# EAGLE design modulator_r1 (EAGLE 6.5.0)
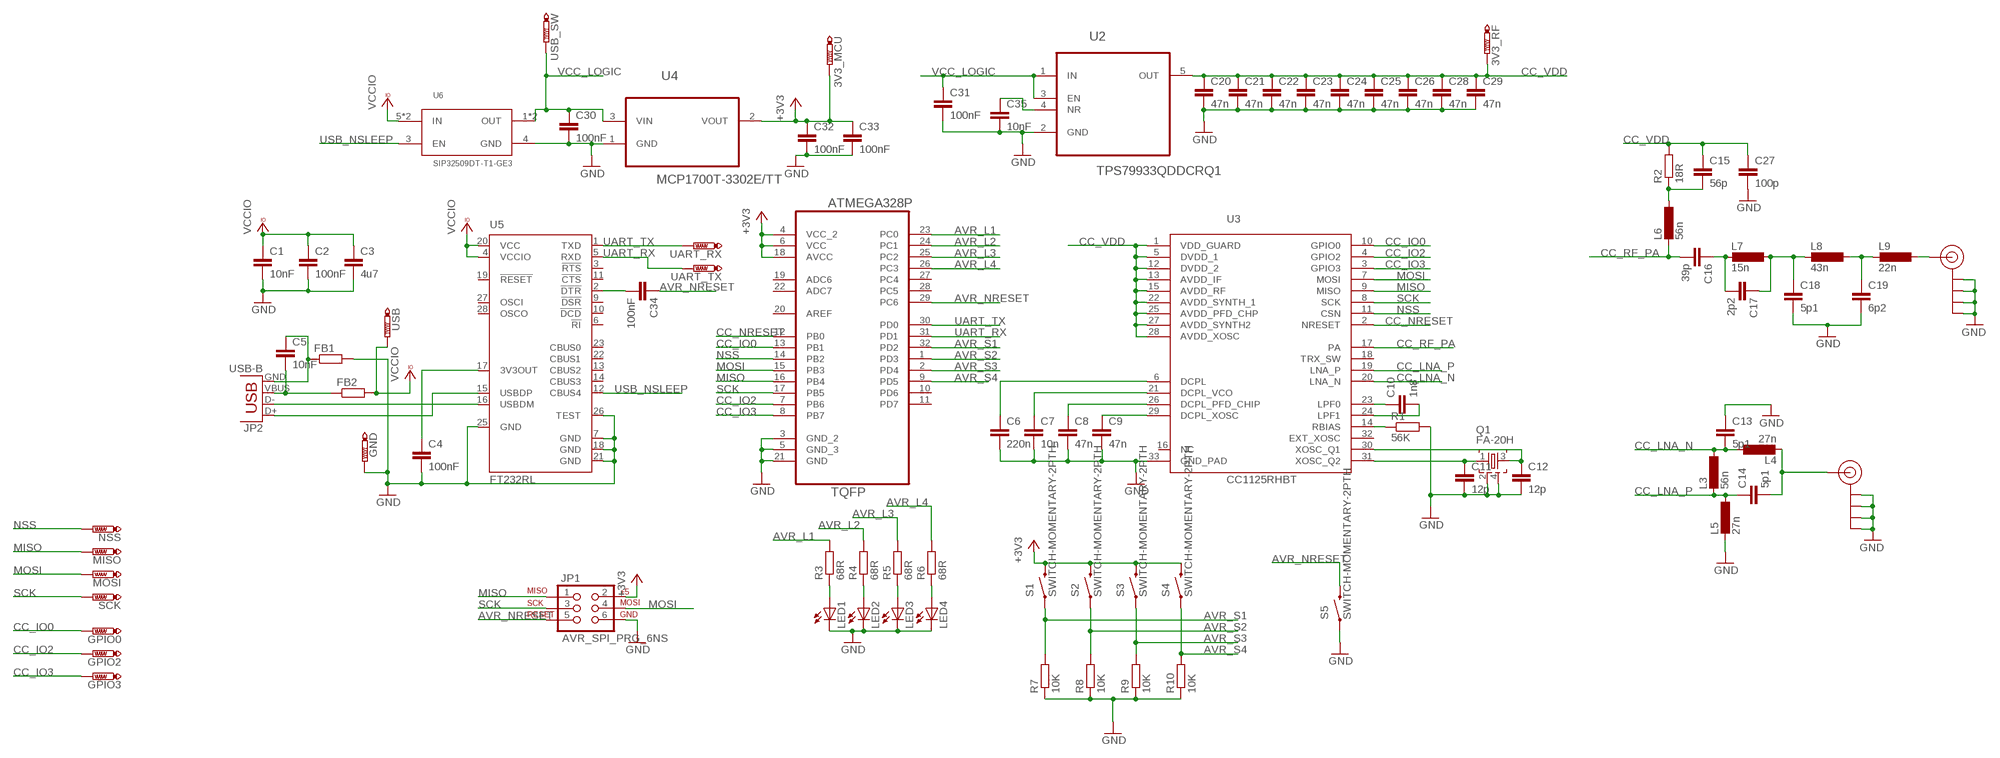
[diagram p0: schematic, sheet 1]

## Parts
3V3_MCU  PTR1B2,54  [B2,54]
3V3_RF  PTR1B2,54  [B2,54]
C1  10nF  C-EUC0603  [C0603]
C2  100nF  C-EUC0603  [C0603]
C3  4u7  C-EUC0603  [C0603]
C4  100nF  C-EUC0603  [C0603]
C5  10nF  C-EUC0603  [C0603]
C6  220n  C-EUC0402  [C0402]
C7  10n  C-EUC0402  [C0402]
C8  47n  C-EUC0402  [C0402]
C9  47n  C-EUC0402  [C0402]
C10  1n8  C-EUC0402  [C0402]
C11  12p  C-EUC0402  [C0402]
C12  12p  C-EUC0402  [C0402]
C13  5p1  C-EUC0402  [C0402]
C14  5p1  C-EUC0402  [C0402]
C15  56p  C-EUC0402  [C0402]
C16  39p  C-EUC0402  [C0402]
C17  2p2  C-EUC0402  [C0402]
C18  5p1  C-EUC0402  [C0402]
C19  6p2  C-EUC0402  [C0402]
C20  47n  C-EUC0402  [C0402]
C21  47n  C-EUC0402  [C0402]
C22  47n  C-EUC0402  [C0402]
C23  47n  C-EUC0402  [C0402]
C24  47n  C-EUC0402  [C0402]
C25  47n  C-EUC0402  [C0402]
C26  47n  C-EUC0402  [C0402]
C27  100p  C-EUC0402  [C0402]
C28  47n  C-EUC0402  [C0402]
C29  47n  C-EUC0402  [C0402]
C30  100nF  C-EUC0603  [C0603]
C31  100nF  C-EUC0603  [C0603]
C32  100nF  C-EUC0603  [C0603]
C33  100nF  C-EUC0603  [C0603]
C34  100nF  C-EUC0603  [C0603]
C35  10nF  C-EUC0603  [C0603]
FB1  R-EU_R0603  [R0603]
FB2  R-EU_R0603  [R0603]
GND  PTR1B2,54  [B2,54]
GPIO0  PTR1B1,27  [B1,27]
GPIO2  PTR1B1,27  [B1,27]
GPIO3  PTR1B1,27  [B1,27]
J$1  SMA_EDGE  [SMA-EDGE]
J$2  SMA_EDGE  [SMA-EDGE]
JP1  AVR_SPI_PRG_6NS  [2X3-NS]
JP2  USB-B  USBPTH  [USB-B-PTH]
L3  56n  L-EUL0402  [R0402]
L4  27n  L-EUL0402  [R0402]
L5  27n  L-EUL0402  [R0402]
L6  56n  L-EUL0402  [R0402]
L7  15n  L-EUL0402  [R0402]
L8  43n  L-EUL0402  [R0402]
L9  22n  L-EUL0402  [R0402]
LED1  LEDCHIPLED_1206  [CHIPLED_1206]
LED2  LEDCHIPLED_1206  [CHIPLED_1206]
LED3  LEDCHIPLED_1206  [CHIPLED_1206]
LED4  LEDCHIPLED_1206  [CHIPLED_1206]
MISO  PTR1B1,27  [B1,27]
MOSI  PTR1B1,27  [B1,27]
NSS  PTR1B1,27  [B1,27]
Q1  FA-20H  [FA-20H]
R1  56K  R-EU_R0402  [R0402]
R2  18R  R-EU_R0402  [R0402]
R3  68R  R-EU_R0603  [R0603]
R4  68R  R-EU_R0603  [R0603]
R5  68R  R-EU_R0603  [R0603]
R6  68R  R-EU_R0603  [R0603]
R7  10K  R-EU_R0603  [R0603]
R8  10K  R-EU_R0603  [R0603]
R9  10K  R-EU_R0603  [R0603]
R10  10K  R-EU_R0603  [R0603]
S1  SWITCH-MOMENTARY-2PTH  [TACTILE-PTH]
S2  SWITCH-MOMENTARY-2PTH  [TACTILE-PTH]
S3  SWITCH-MOMENTARY-2PTH  [TACTILE-PTH]
S4  SWITCH-MOMENTARY-2PTH  [TACTILE-PTH]
S5  SWITCH-MOMENTARY-2PTH  [TACTILE-PTH]
SCK  PTR1B1,27  [B1,27]
U1  ATMEGA328P-AU  [QFP80P900X900X120-32N]
U2  TPS79933QDDCRQ1  [SOT95P280X110-5N]
U3  CC1125RHBT  [QFN50P500X500X100-32N]
U4  MCP1700T-3302E/TT  [SOT95P237X112-3N]
U5  FT232RL  [SSOP28]
U6  SIP32509DT-T1-GE3  [SOT23-6]
UART_RX  PTR1B1,27  [B1,27]
UART_TX  PTR1B1,27  [B1,27]
USB  PTR1B2,54  [B2,54]
USB_SW  PTR1B2,54  [B2,54]

## Nets
+3V3: 3V3_MCU.TP C32.1 C33.1 JP1.2 S1.3 S2.3 S3.3 S4.3 U1.4(VCC_2) U1.6(VCC) U1.18(AVCC) U4.2(VOUT)
AVR_L1: R3.2 U1.23(PC0)
AVR_L2: R4.2 U1.24(PC1)
AVR_L3: R5.2 U1.25(PC2)
AVR_L4: R6.2 U1.26(PC3)
AVR_NRESET: C34.1 JP1.5 S5.3 U1.29(PC6)
AVR_S1: R7.2 S1.1 U1.32(PD2)
AVR_S2: R8.2 S2.1 U1.1(PD3)
AVR_S3: R9.2 S3.1 U1.2(PD4)
AVR_S4: R10.2 S4.1 U1.9(PD5)
CC_IO0: GPIO0.TP U1.13(PB1) U3.10(GPIO0)
CC_IO2: GPIO2.TP U1.7(PB6) U3.4(GPIO2)
CC_IO3: GPIO3.TP U1.8(PB7) U3.3(GPIO3)
CC_LNA_N [RF]: C13.2 L3.1 L4.1 U3.20(LNA_N)
CC_LNA_P [RF]: C14.1 L3.2 L5.1 U3.19(LNA_P)
CC_NRESET: U1.12(PB0) U3.2(NRESET)
CC_RF_PA [RF]: C16.2 L6.2 U3.17(PA)
CC_VDD: 3V3_RF.TP C15.1 C20.1 C21.1 C22.1 C23.1 C24.1 C25.1 C26.1 C27.1 C28.1 C29.1 R2.2 U2.5(OUT) U3.1(VDD_GUARD) U3.5(DVDD_1) U3.12(DVDD_2) U3.13(AVDD_IF) U3.15(AVDD_RF) U3.22(AVDD_SYNTH_1) U3.25(AVDD_PFD_CHP) U3.27(AVDD_SYNTH2) U3.28(AVDD_XOSC)
GND: C1.2 C2.2 C3.2 C4.2 C6.2 C7.2 C8.2 C9.2 C11.2 C12.2 C13.1 C18.2 C19.2 C20.2 C21.2 C22.2 C23.2 C24.2 C25.2 C26.2 C27.2 C28.2 C29.2 C30.2 C31.2 C32.2 C33.2 C35.2 FB1.2 GND.TP J$1.GND@0(GND) J$1.GND@1(GND) J$1.GND@2(GND) J$1.GND@3(GND) J$2.GND@0(GND) J$2.GND@1(GND) J$2.GND@2(GND) J$2.GND@3(GND) JP1.6 L5.2 LED1.C LED2.C LED3.C LED4.C Q1.2 Q1.4 R1.2 R7.1 R8.1 R9.1 R10.1 S5.1 U1.3(GND_2) U1.5(GND_3) U1.21(GND) U2.2(GND) U3.33(GND_PAD) U4.1(GND) U5.7(GND) U5.18(GND) U5.21(GND) U5.25(GND) U5.26(TEST) U6.4(GND)
MISO: JP1.1 MISO.TP U1.16(PB4) U3.9(MISO)
MOSI: JP1.4 MOSI.TP U1.15(PB3) U3.7(MOSI)
N$1: JP2.D- U5.16(USBDM)
N$2: JP2.D+ U5.15(USBDP)
N$3: C5.1 FB1.1 JP2.GND
N$4: C5.2 FB2.1 JP2.VBUS
N$5: C4.1 U5.17(3V3OUT)
N$6 [RF]: J$2.SIG(SIGNAL) L9.1
N$7: R1.1 U3.14(RBIAS)
N$8: C9.1 U3.29(DCPL_XOSC)
N$9: C8.1 U3.26(DCPL_PFD_CHIP)
N$10: C7.1 U3.21(DCPL_VCO)
N$11: C6.1 U3.6(DCPL)
N$12: C10.2 U3.24(LPF1)
N$13: C10.1 U3.23(LPF0)
N$14: C11.1 Q1.1 U3.31(XOSC_Q2)
N$15: C19.1 L8.1 L9.2
N$16: C12.1 Q1.3 U3.30(XOSC_Q1)
N$17 [RF]: C14.2 J$1.SIG(SIGNAL) L4.2
N$18 [RF]: C17.1 C18.1 L7.1 L8.2
N$19 [RF]: C16.1 C17.2 L7.2
N$20: C34.2 U5.2(!DTR)
N$21: C15.2 L6.1 R2.1
N$22: LED1.A R3.1
N$23: LED2.A R4.1
N$24: LED3.A R5.1
N$25: LED4.A R6.1
N$30: C35.1 U2.4(NR)
NSS: NSS.TP U1.14(PB2) U3.11(CSN)
SCK: JP1.3 SCK.TP U1.17(PB5) U3.8(SCK)
UART_RX: U1.31(PD1) U5.5(RXD) UART_TX.TP
UART_TX: U1.30(PD0) U5.1(TXD) UART_RX.TP
USB_NSLEEP: U5.12(CBUS4) U6.3(EN)
VCC_LOGIC: C30.1 C31.1 U2.1(IN) U2.3(EN) U4.3(VIN) U6.1(OUT) U6.2(OUT) USB_SW.TP
VCCIO: C1.1 C2.1 C3.1 FB2.2 U5.4(VCCIO) U5.20(VCC) U6.5(IN) U6.6(IN) USB.TP
Unconnected: U1.10(PD6) U1.11(PD7) U1.19(ADC6) U1.20(AREF) U1.22(ADC7) U1.27(PC4) U1.28(PC5) U3.16(NC) U3.18(TRX_SW) U3.32(EXT_XOSC) U5.3(!RTS) U5.6(!RI) U5.9(!DSR) U5.10(!DCD) U5.11(!CTS) U5.13(CBUS2) U5.14(CBUS3) U5.19(!RESET) U5.22(CBUS1) U5.23(CBUS0) U5.27(OSCI) U5.28(OSCO)

## Library data of the parts
3V3_MCU 3V3_RF GND GPIO0 GPIO2 GPIO3 MISO MOSI NSS SCK UART_RX UART_TX USB USB_SW = testpad:PTR1: TEST PIN
C1-C35 = resistor:C-EU: CAPACITOR, European symbol
FB1 FB2 R1-R10 = resistor:R-EU_: RESISTOR, European symbol
J$1 J$2 = SparkFun-Connectors:SMA_EDGE: SMA Antenna Connector End launch SMA connector. The paste layer has been removed so that the connector can be hand soldered onto the board after reflow.
JP1 = SparkFun-Connectors:AVR_SPI_PRG_6: AVR ISP 6 Pin This is the reduced ISP connector for AVR programming. Common on Arduino. This footprint will take up less PCB space and can be used with a 10-pin to 6-pin adapter such as SKU: BOB-08508 **Special note about "TEST_POINT" package. The stop mask is on the top side, so if you want your programming test points to be on the bottom of your board, make sure to place this package on the bottom side of the board. This also ensure that the orientation to program from the bottom side will be correct.
JP2 = SparkFun-Connectors:USB: USB Connectors USB-B-PTH is fully proven SKU : PRT-00139/CONN-08278 USB-miniB is fully proven SKU : PRT-00587 USB-A-PCB is untested. USB-A-H is throughly reviewed, but untested. Spark Fun Electronics SKU : PRT-00437 USB-B-SMT is throughly reviewed, but untested. Needs silkscreen touching up. USB-A-S has not been used/tested USB-MB-H has not been used/tested USB-MICROB has been used. CONN-09505; PROD_ID: CONN-08278
L3-L9 = resistor:L-EU: INDUCTOR, European symbol
LED1-LED4 = led:LED: LED OSRAM: - CHIPLED LG R971, LG N971, LY N971, LG Q971, LY Q971, LO R971, LY R971 LH N974, LH R974 LS Q976, LO Q976, LY Q976 LO Q996 - Hyper CHIPLED LW Q18S LB Q993, LB Q99A, LB R99A - SideLED LS A670, LO A670, LY A670, LG A670, LP A670 LB A673, LV A673, LT A673, LW A673 LH A674 LY A675 LS A676, LA A676, LO A676, LY A676, LW A676 LS A679, LY A679, LG A679 - Hyper Micro SIDELED® LS Y876, LA Y876, LO Y876, LY Y876 LT Y87S - SmartLED LW L88C, LW L88S LB L89C, LB L89S, LG L890 LS L89K, LO L89K, LY L89K LS L896, LA L896, LO L896, LY L896 - TOPLED LS T670, LO T670, LY T670, LG T670, LP T670 LSG T670, LSP T670, LSY T670, LOP T670, LYG T670 LG T671, LOG T671, LSG T671 LB T673, LV T673, LT T673, LW T673 LH T674 LS T676, LA T676, LO T676, LY T676, LB T676, LH T676, LSB T676, LW T676 LB T67C, LV T67C, LT T67C, LS T67K, LO T67K, LY T67K, LW E67C LS E67B, LA E67B, LO E67B, LY E67B, LB E67C, LV E67C, LT E67C LW T67C LS T679, LY T679, LG T679 LS T770, LO T770, LY T770, LG T770, LP T770 LB T773, LV T773, LT T773, LW T773 LH T774 LS E675, LA E675, LY E675, LS T675 LS T776, LA T776, LO T776, LY T776, LB T776 LHGB T686 LT T68C, LB T68C - Hyper Mini TOPLED® LB M676 - Mini TOPLED Santana® LG M470 LS M47K, LO M47K, LY M47K Source: http://www.osram.convergy.de LUXEON: - LUMILED® LXK2-PW12-R00, LXK2-PW12-S00, LXK2-PW14-U00, LXK2-PW14-V00 LXK2-PM12-R00, LXK2-PM12-S00, LXK2-PM14-U00 LXK2-PE12-Q00, LXK2-PE12-R00, LXK2-PE12-S00, LXK2-PE14-T00, LXK2-PE14-U00 LXK2-PB12-K00, LXK2-PB12-L00, LXK2-PB12-M00, LXK2-PB14-N00, LXK2-PB14-P00, LXK2-PB14-Q00 LXK2-PR12-L00, LXK2-PR12-M00, LXK2-PR14-Q00, LXK2-PR14-R00 LXK2-PD12-Q00, LXK2-PD12-R00, LXK2-PD12-S00 LXK2-PH12-R00, LXK2-PH12-S00 LXK2-PL12-P00, LXK2-PL12-Q00, LXK2-PL12-R00 Source: www.luxeon.com KINGBRIGHT: KA-3528ASYC Source: www.kingbright.com
Q1 = crystal:FA-: MHz RANGE CRYSTAL UNIT Source: Epson Toyocom
S1-S5 = SparkFun-Electromechanical:SWITCH-MOMENTARY-2: Various NO switches- pushbuttons, reed, etc; PROD_ID: SWCH-08441
U1 = Ava:ATMEGA328P-AU; DESCRIPTION: 8-bit Microcontroller with In-System Programmable Flash; MPN: ATMEGA328P-AU; OC_FARNELL: 1715486; OC_NEWARK: 14R4631; PACKAGE: TQFP-32; SUPPLIER: Atmel
U2 = Texas Instruments_By_element14_Batch_1:TPS79933QDDCRQ1: LINEAR REGULATOR; MPN: TPS79933QDDCRQ1; OC_FARNELL: -; OC_NEWARK: 25R0151; PACKAGE: SOT-5; SUPPLIER: Texas Instruments
U3 = Texas Instruments_By_element14_Batch_1:CC1125RHBT; FARNELL_OC: 2422924
U4 = Ava:MCP1700T-3302E/TT: Low Quiescent Current LDO; MPN: MCP1700T-3302E/TT; OC_FARNELL: 1296592; OC_NEWARK: 88H9817; PACKAGE: SOT23-3; SUPPLIER: Microchip
U5 = ftdichip:FT232R: Source: http://www.ftdichip.com/Documents/DataSheets/DS_FT232R_v104.pdf; MPN: FT232RL; OC_FARNELL: 1146032; OC_NEWARK: 91K9918
U6 = phil-ic:SIP32509DT-T1-GE3: 1.1 V to 5.5 V, Slew Rate Controlled Load Switch; OC_FARNELL: 2361513

## Net classes
1 RF: clearance 0.254 mm

## Board
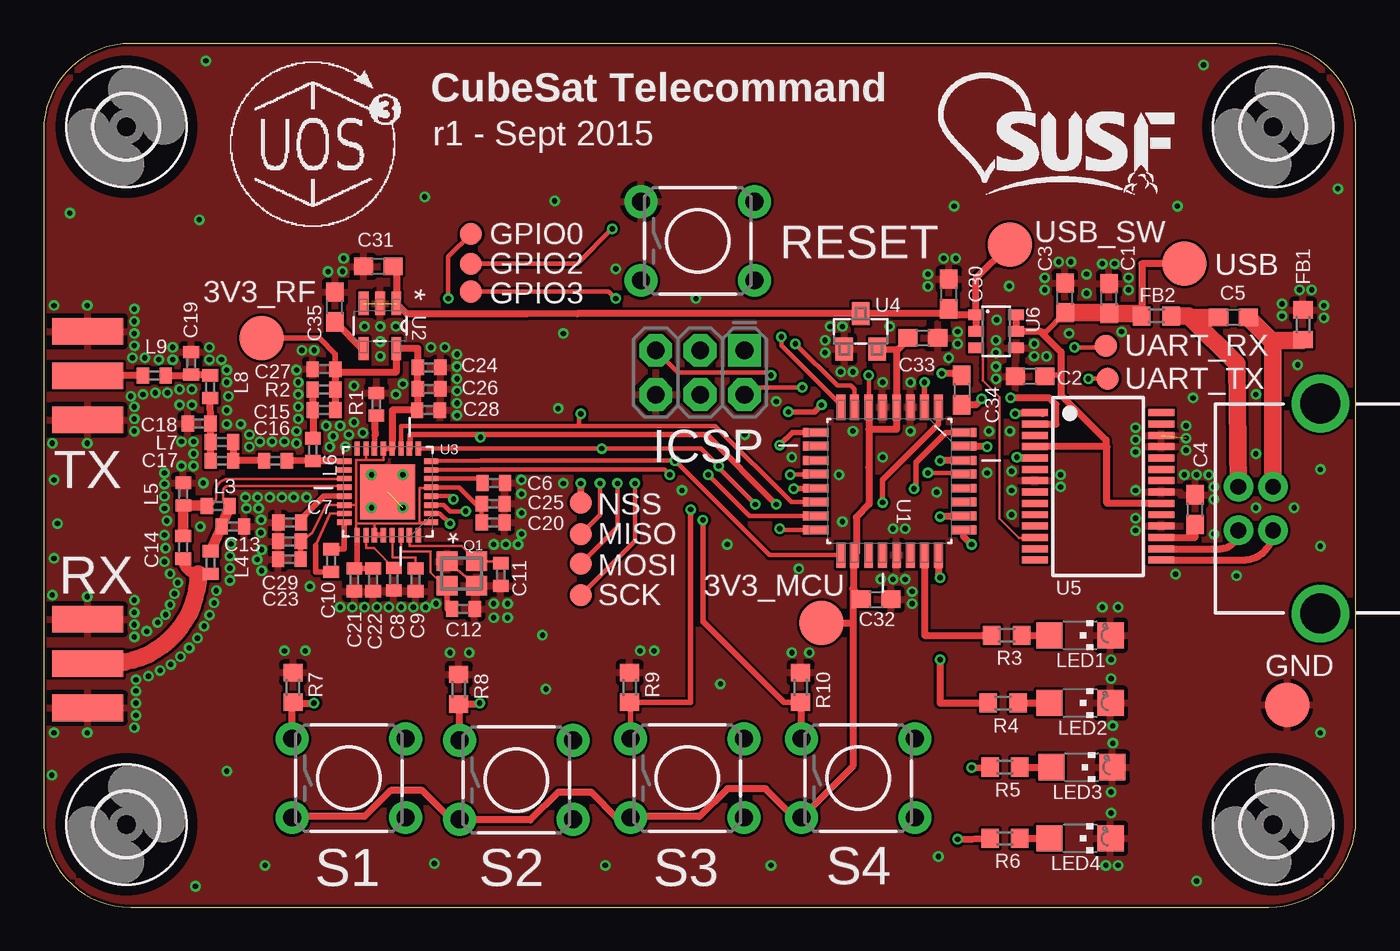
[diagram p1: board, top side]
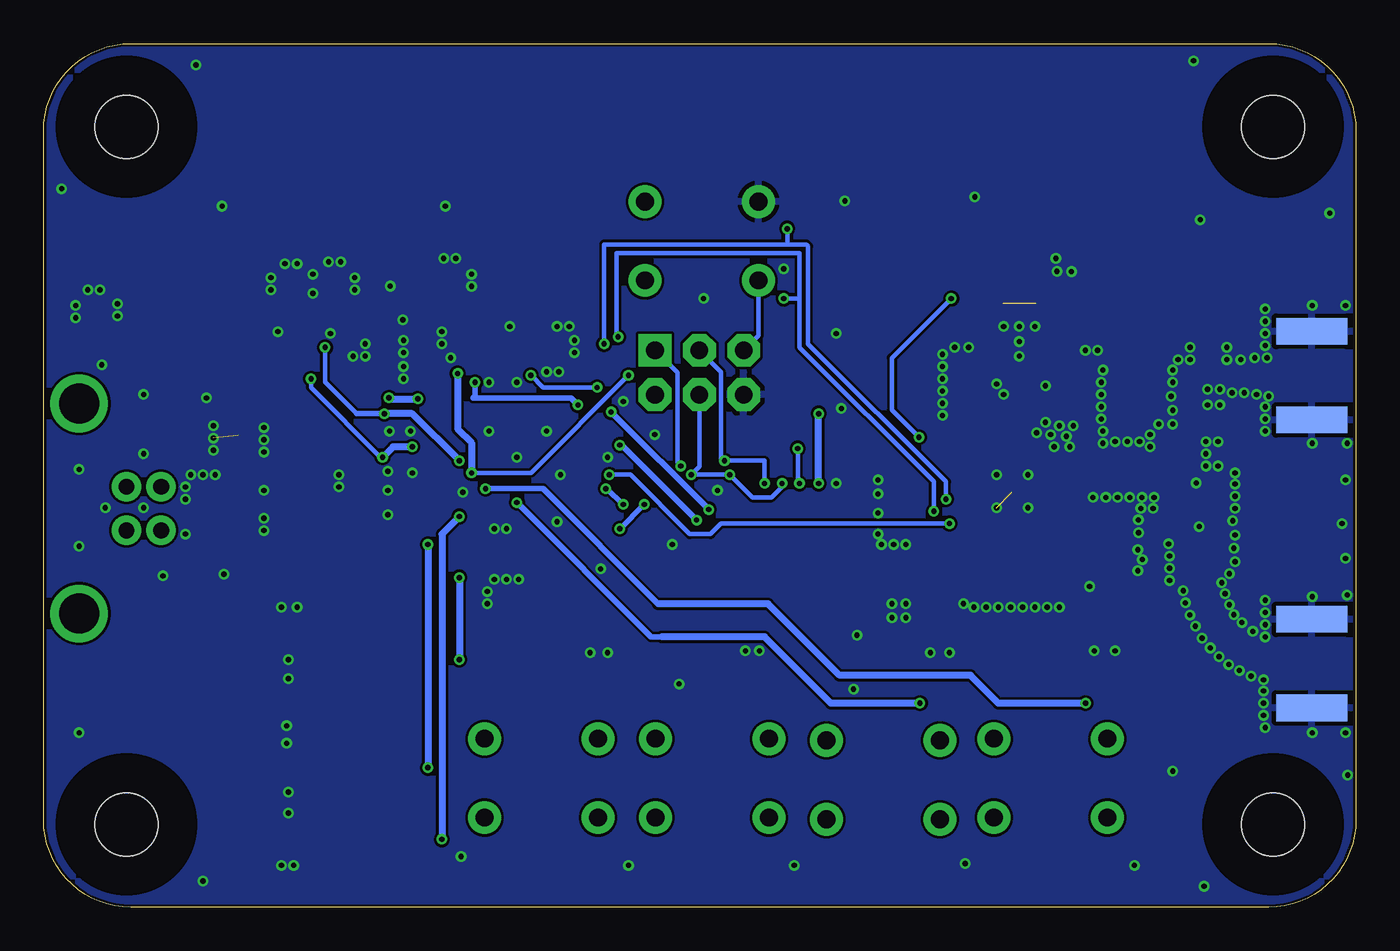
[diagram p2: board, bottom side, seen from below]

Size 75.23 x 49.52 mm. Coordinates in mm from the lower left corner, seen from the top.
Outline: 5,0 70.23,0 arc90 75.23,5 75.23,44.52 arc90 70.23,49.52 5,49.52 arc90 0,44.52 0,5 arc90 5,0
Copper layers (1*16): Top 0.035mm / dielectric 1.5mm / Bottom 0.035mm
Design rules "Hackvana": minimum track width 6mil, minimum drill 0.3mm, track to track 6mil, track to pad 6mil, pad to pad 6mil, via to via 6mil, smd to smd 0mil, copper to edge 6mil, drill to drill 6mil, minimum pad ring 10mil, minimum via ring 6mil, stop-mask expansion 2mil, vias tented up to drill 100mil, thermal gap 10mil

### Footprints (pad centres in the part's own frame; a part is rotated, then mirrored left to right if it is on the bottom)
B2,54 = smd 2.54 x 2.54: TP 0,0
C0603 = smd 1.1 x 1: 1 -0.85,0; 2 0.85,0
C0402 = smd 0.7 x 0.9: 1 -0.65,0; 2 0.65,0
R0603 = smd 1 x 1.1: 1 -0.85,0; 2 0.85,0
B1,27 = smd 1.27 x 1.27: TP 0,0
SMA-EDGE = smd 1.524 x 4.064: GND@0 0,0; GND@1 5.08,0; SIG 2.54,0 | smd 1.524 x 4.064 bottom: GND@2 0,0; GND@3 5.08,0
2X3-NS = drill 1.016 pad 1.88 square: 1 -2.54,-1.27 | drill 1.016 pad 1.88 octagon: 2 -2.54,1.27; 3 0,-1.27; 4 0,1.27; 5 2.54,-1.27; 6 2.54,1.27
USB-B-PTH = drill 0.914 pad 1.676: D+ 0,1.25; D- 1.981,1.25; GND 0,-1.25; VBUS 1.981,-1.25 | drill 2.286: S1 -2.718,-6.02; S2 -2.718,6.02
R0402 = smd 0.7 x 0.9: 1 -0.65,0; 2 0.65,0
CHIPLED_1206 = smd 1.5 x 1.5: A 0,-1.75; C 0,1.75
FA-20H = smd 1.2 x 1.1: 1 -0.85,-0.7; 2 0.85,-0.7; 3 0.85,0.7; 4 -0.85,0.7
TACTILE-PTH = drill 1.016 pad 1.88: 1 -3.251,2.261; 2 3.251,2.261; 3 -3.251,-2.261; 4 3.251,-2.261
QFP80P900X900X120-32N = smd 1.473 x 0.508: 1 -4.242,2.794; 2 -4.242,2.007; 3 -4.242,1.194; 4 -4.242,0.406; 5 -4.242,-0.406; 6 -4.242,-1.194; 7 -4.242,-2.007; 8 -4.242,-2.794; 17 4.242,-2.794; 18 4.242,-2.007; 19 4.242,-1.194; 20 4.242,-0.406; 21 4.242,0.406; 22 4.242,1.194; 23 4.242,2.007; 24 4.242,2.794 | smd 0.508 x 1.473: 9 -2.794,-4.242; 10 -2.007,-4.242; 11 -1.194,-4.242; 12 -0.406,-4.242; 13 0.406,-4.242; 14 1.194,-4.242; 15 2.007,-4.242; 16 2.794,-4.242; 25 2.794,4.242; 26 2.007,4.242; 27 1.194,4.242; 28 0.406,4.242; 29 -0.406,4.242; 30 -1.194,4.242; 31 -2.007,4.242; 32 -2.794,4.242
SOT95P280X110-5N = smd 1.321 x 0.559: 1 -1.295,0.94; 2 -1.295,0; 3 -1.295,-0.94; 4 1.295,-0.94; 5 1.295,0.94
QFN50P500X500X100-32N = smd 0.813 x 0.305: 1 -2.489,1.753; 2 -2.489,1.245; 3 -2.489,0.762; 4 -2.489,0.254; 5 -2.489,-0.254; 6 -2.489,-0.762; 7 -2.489,-1.245; 8 -2.489,-1.753; 17 2.489,-1.753; 18 2.489,-1.245; 19 2.489,-0.762; 20 2.489,-0.254; 21 2.489,0.254; 22 2.489,0.762; 23 2.489,1.245; 24 2.489,1.753 | smd 0.305 x 0.813: 9 -1.753,-2.489; 10 -1.245,-2.489; 11 -0.762,-2.489; 12 -0.254,-2.489; 13 0.254,-2.489; 14 0.762,-2.489; 15 1.245,-2.489; 16 1.753,-2.489; 25 1.753,2.489; 26 1.245,2.489; 27 0.762,2.489; 28 0.254,2.489; 29 -0.254,2.489; 30 -0.762,2.489; 31 -1.245,2.489; 32 -1.753,2.489 | smd 3.15 x 3.15: 33 0,0
SOT95P237X112-3N = smd 0.991 x 1.321: 1 -0.94,-1.016; 2 0.94,-1.016; 3 0,1.016
SSOP28 = smd 0.4 x 1.5: 1 -4.225,-3.625; 2 -3.575,-3.625; 3 -2.925,-3.625; 4 -2.275,-3.625; 5 -1.625,-3.625; 6 -0.975,-3.625; 7 -0.325,-3.625; 8 0.325,-3.625; 9 0.975,-3.625; 10 1.625,-3.625; 11 2.275,-3.625; 12 2.925,-3.625; 13 3.575,-3.625; 14 4.225,-3.625; 15 4.225,3.625; 16 3.575,3.625; 17 2.925,3.625; 18 2.275,3.625; 19 1.625,3.625; 20 0.975,3.625; 21 0.325,3.625; 22 -0.325,3.625; 23 -0.975,3.625; 24 -1.625,3.625; 25 -2.275,3.625; 26 -2.925,3.625; 27 -3.575,3.625; 28 -4.225,3.625
SOT23-6 = smd 0.6 x 0.9: 1 -0.95,-1.15; 2 0,-1.15; 3 0.95,-1.15; 4 0.95,1.15; 5 0,1.15; 6 -0.95,1.15
3,6 = hole 3.6: 0,0

### Placement (x,y rotation side)
3V3_MCU  44.6,16.3 0 top
3V3_RF  12.5,32.63 0 top
C1  61.09,34.9 90 top
C2  56.56,30.43 180 top
C3  58.56,34.94 90 top
C4  66.02,22.8 90 top
C5  68.21,33.82 180 top
C6  25.81,24.32 0 top
C7  14.11,22.06 180 top
C8  20.08,18.81 270 top
C9  21.33,18.77 270 top
C10  16.48,19.88 90 top
C11  26.21,19.07 270 top
C12  24.07,17.1 0 top
C13  10.85,21.83 180 top
C14  8,20.64 270 top
C15  16.07,28.51 180 top
C16  13.3,25.6 0 top
C17  10.22,25.6 0 top
C18  8.92,27.74 180 top
C19  8.46,31.18 90 top
C20  25.77,22.06 0 top
C21  17.82,18.77 270 top
C22  18.89,18.77 270 top
C23  14.09,19.95 180 top
C24  22.1,30.95 0 top
C25  25.77,23.14 0 top
C26  22.1,29.72 0 top
C27  16.07,30.85 180 top
C28  22.07,28.5 0 top
C29  14.1,20.98 180 top
C30  51.9,35.16 90 top
C31  19.19,36.74 180 top
C32  47.72,17.65 0 top
C33  50.41,32.64 0 top
C34  52.64,29.65 270 top
C35  16.7,34.42 90 top
FB1  72.2,33.4 90 top
FB2  63.8,33.9 180 top
GND  71.3,11.6 0 top
GPIO0  24.5,38.6 0 top
GPIO2  24.5,36.9 0 top
GPIO3  24.5,35.3 0 top
J$1  2.54,11.43 90 top
J$2  2.54,27.94 90 top
JP1  37.64,30.66 180 top
JP2  70.48,22.86 180 top
L3  10.01,23.01 180 top
L4  9.58,19.77 270 top
L5  8.01,23.69 90 top
L6  15.44,26.23 270 top
L7  10.22,26.67 0 top
L8  9.55,29.84 270 top
L9  6.35,30.48 0 top
LED1  59.42,15.59 270 top
LED2  59.42,11.71 270 top
LED3  59.52,8.03 270 top
LED4  59.42,3.95 270 top
MISO  30.8,21.4 0 top
MOSI  30.8,19.7 0 top
NSS  30.8,23.2 0 top
Q1  23.97,19.14 180 top
R1  19.08,28.84 90 top
R2  16.07,29.68 0 top
R3  55.21,15.59 180 top
R4  55.01,11.71 180 top
R5  55.11,8.03 180 top
R6  55.11,3.95 180 top
R7  14.3,12.6 270 top
R8  23.8,12.5 270 top
R9  33.6,12.6 270 top
R10  43.4,12.6 270 top
S1  17.5,7.4 0 top
S2  27.1,7.3 0 top
S3  36.9,7.4 0 top
S4  46.7,7.4 0 top
S5  37.5,38.2 0 top
SCK  30.8,17.9 0 top
U1  48.5,24.43 270 top
U2  19.29,33.33 270 top
U3  19.73,23.82 180 top
U4  46.84,33.02 0 top
U5  60.46,24.13 270 top
U6  54.61,33.02 270 top
U$1  [SUSF-XSM]  51.3,40.87 0 top
U$2  [3,6]  4.75,4.75 0 top
U$3  [3,6]  70.48,4.75 0 top
U$4  [3,6]  70.48,44.75 0 top
U$5  [3,6]  4.75,44.75 0 top
UART_RX  60.9,32.2 0 top
UART_TX  61,30.3 0 top
USB  65.4,36.9 0 top
USB_SW  55.4,38 0 top

### Tracks (layer width: path | path; a pad name or v marks a point on that pad's centre or on a via)
+3V3  (via drill 0.3)
  Top 0.152: 46.44,20.14 U1.18
  Top 0.254: JP1.2 40.59,29.8 v43.5,29.8 | U1.6 v47.31,30.49 v47.3,30.5
  Top 0.406: U4.2 48.91,31.98 48.91,31.9 | 48.91,31.9 U1.4 48.91,27.4 47.31,27.4 | U1.6 47.31,27.4 | 47.31,27.4 47.31,25.23 47.33,25.21 47.33,23.11 46.59,22.37 46.59,20.29 U1.18 | C33.1 49.56,32.55 48.91,31.9 | 46.44,20.14 46.44,18.25 C32.1 46.4,18.25 46.4,16.3 | 46.4,16.3 46.4,8.09 S4.3 43.06,5.14 41.4,6.8 39.2,6.8 37.6,5.2 33.71,5.2 S3.3 32.86,5.14 31.4,6.6 29.5,6.6 27.9,5 23.89,5 S2.3 23.36,5.04 21.7,6.7 19.9,6.7 18.4,5.2 14.31,5.2 S1.3 | 3V3_MCU.TP 46.4,16.3
  Bottom 0.254: v43.5,29.8 46.6,29.8 v47.3,30.5
AVR_L1
  Top 0.406: U1.23 50.51,15.59 R3.2
AVR_L2  (via drill 0.3)
  Top 0.406: U1.24 51.29,18.9 v51.4,18.9 | v51.4,14.2 51.4,11.71 R4.2
  Bottom 0.406: v51.4,18.9 v51.4,14.2
AVR_L3  (via drill 0.3)
  Top 0.406: U1.25 52.74,21.26 v53.2,20.8 | v53.2,8 54.17,8.03 R5.2
  Bottom 0.406: v53.2,20.8 v53.2,8
AVR_L4  (via drill 0.3)
  Top 0.406: U1.26 52.72,22.4 v51.4,22.4 | v52.4,3.9 R6.2
  Bottom 0.406: v51.4,22.4 52.4,21.4 v52.4,3.9
AVR_NRESET  (via drill 0.3)
  Top 0.254: U1.29 52.74,24.9 v50.7,24.9 | v41.7,30.5 41.55,30.65 36.38,30.65 JP1.5
  Top 0.406: C34.1 52.54,30.61 v51.5,30.61
  Bottom 0.254: v50.7,24.9 47.3,24.9 v41.7,30.5 | S5.3 34.25,32.78 JP1.5
  Bottom 0.406: v51.5,30.61 51.5,27.43 50.7,26.63 v50.7,24.9
AVR_S1  (via drill 0.3)
  Top 0.305: v49.9,24 50,24.1 50,25.5 51.72,27.22 U1.32
  Top 0.406: S1.1 14.25,11.75 R7.2 14.3,11.7 v15.5,11.7
  Bottom 0.305: 40,17.4 46.6,24 v49.9,24
  Bottom 0.406: v15.5,11.7 20.5,11.7 22.1,13.3 29.6,13.3 33.7,17.4 40,17.4
AVR_S2  (via drill 0.3)
  Top 0.305: U1.1 51.29,27.69 48.1,24.5 v48.1,23.2
  Top 0.406: S2.1 23.85,11.65 | 23.85,11.65 R8.2 | 23.85,11.65 24.95,11.65 v25,11.7
  Bottom 0.305: v48.1,23.2 40.4,15.5 39.7,15.5
  Bottom 0.406: v25,11.7 30.1,11.7 33.9,15.5 39.7,15.5 39.8,15.5
AVR_S3  (via drill 0.3)
  Top 0.305: S3.1 33.65,11.7 R9.2 37.1,11.75 v37.1,22.8 | v42.7,28.4 44.2,28.4 v44.6,28.8 | v50.5,30.1 v50.51,30.09 U1.2
  Bottom 0.305: v37.1,22.8 v42.7,28.4 | v44.6,28.8 45,29.2 50.6,29.2 50.5,29.3 v50.5,30.1
AVR_S4  (via drill 0.3)
  Top 0.305: R10.2 42.45,11.75 37.8,16.4 v37.8,22.2 | v42.2,26.5 42.92,27.22 U1.9
  Top 0.406: S4.1 43.45,11.75 R10.2
  Bottom 0.305: v37.8,22.2 42.1,26.5 v42.2,26.5
CC_IO0  (via drill 0.3)
  Top 0.254: GPIO0.TP 23.2,37.3 v23.2,34.9
  Top 0.305: U3.10 21,26.31 21,27.1 25,27.1 | v42,23.1 38,27.1 25,27.1 | v43,24 44.23,24 U1.13 | v25.05,26.95 25.05,27.05 25,27.1
  Bottom 0.254: v23.2,34.9 26.6,31.5 26.6,28.5 v25.05,26.95
  Bottom 0.305: v42,23.1 v43,24
CC_IO2  (via drill 0.3)
  Top 0.254: U1.7 46.49,29.71 46.3,29.9 45.5,29.9 v43.1,32.3 | U3.4 23.33,23.57 v23.5,23.4 | GPIO2.TP 30.6,36.9 v32.6,38.9
  Bottom 0.254: v23.5,23.4 23.5,24.4 31.4,32.3 31.4,37.9 31.5,38 32.6,38 | 32.6,38 43.1,38 v43.1,32.3 | v32.6,38.9 32.6,38
CC_IO3  (via drill 0.3)
  Top 0.254: U1.8 45.71,28.79 42.3,32.2 v42.3,32.7 | U3.3 22.94,23.06 23.3,22.7 v24.2,22.7 | GPIO3.TP 32.4,35.3 v32.8,34.9
  Bottom 0.254: v42.3,32.7 42.4,32.8 42.4,37.5 31.9,37.5 31.9,34.9 | 31.9,34.9 31.9,32.1 24.2,24.4 v24.2,22.7 | v32.8,34.9 31.9,34.9
CC_LNA_N
  Top 0.152: U3.20 17.17,24.15 10.57,24.15 arc90 10.3,23.88 10.3,23.38 arc90 L3.1
  Top 0.61: L3.1 C13.2 L4.1
CC_LNA_P
  Top 0.152: U3.19 17.21,24.55 10.57,24.55 arc90 9.89,23.88 9.89,23.54 arc-90 L3.2 arc90 9.34,23.04
  Top 0.61: C14.1 L5.1 arc-90 L5.1 9.34,23.04
CC_NRESET  (via drill 0.3)
  Top 0.254: U3.2 22.7,22.57 v23.3,22 | v42.8,24.8 44.22,24.8 U1.12
  Bottom 0.254: v23.3,22 36.4,22 37,21.4 38.2,21.4 41.6,24.8 v42.8,24.8
CC_RF_PA
  Top 0.305: U3.17 16.54,25.59
  Top 0.406: C16.2 L6.2 16.54,25.59
CC_VDD
  Top 0.15: 17.93,22 17.93,21.38 U3.25 | 18.97,22 22.15,22 U3.1 21.55,22.07 21.55,24.05 22.22,24.05 U3.5
  Top 0.152: C29.1 15.4,21.46 16.19,23.06 U3.22 17.93,23.06 | 17.93,23.06 17.93,22 18.97,22 U3.27 | U3.13 19.5,26.31 19.5,25.65 18.48,25.65 | 18.48,25.65 U3.15 | 18.48,25.65 17.93,25.65 17.93,23.06 | C15.1 16.7,28.51 16.7,30.7 | C23.1
  Top 0.254: 19.5,26.21 U3.13 | U3.5 23.83,24.07 24.8,23.1 25.06,23.1 C25.1 C20.1
  Top 0.305: U3.13 U3.12 | U3.25 17.98,19.42 | 17.98,19.42 C21.1 | 17.98,19.42 C22.1 | U3.27 U3.28 | C29.1 C23.1 | C27.1 16.73,31.73 15.81,32.64 3V3_RF.TP
  Top 0.406: C15.1 R2.2 C27.1 | U3.12 19.98,28.5 C28.1 21.45,28.6 C26.1 C24.1 21.45,32.03 U2.5 20.23,30.7 16.7,30.7
GND  (via drill 0.3)  (2 unrouted)
  Top 0.152: Q1.2 Q1.4
  other vias: 20.6,24.8 20.6,22.9 18.8,22.9 18.8,24.8 20.2,29.4 17.5,27.1 19.3,32.43 19.3,31.6 0.8,22 15.07,23.5 14.34,23.5 13.66,23.5 12.47,22.21 12.24,19.93 6.53,16.32 5.3,13.04 5.3,12.4 5.3,11.7 5.3,11 5.2,10.3 5.2,15.5 5.2,16.2 5.2,16.9 5.2,17.6 5.91,15.82 8.82,15.42 8.35,14.87 7.84,14.36 7.29,13.92 6.68,13.57 6.01,13.25 5.1,31.5 5.2,32.2 5.2,32.9 5.2,33.6 5.2,34.3 5,29.3 5.2,28.7 5.2,28 5.2,27.3 5.7,29.4 6.4,29.5 7.1,29.5 7.8,29.7 8.5,29.7 8.5,28.8 7.8,28.8 7.9,26.7 8.6,26.7 8.6,26 8.6,25.3 5.8,31.5 6.6,31.4 7.4,31.4 7.4,32.1 9.5,31.4 9.5,32.1 10.2,31.4 10.5,30.8 10.5,30.1 10.6,29.3 10.5,28.5 10.5,27.7 11.8,26.4 11.8,27.1 11.3,27.7 14.5,26.6 13.8,26.7 12.4,26.7 13.1,26.7 14.5,27.3 14.6,28 14.6,28.7 14.6,29.4 14.6,30.1 14.5,30.8 16.2,27.6 16.4,26.4 16.6,27 17.3,26.4 18.3,27.2 17,27.6 17.8,27.8 17.8,29.9 20.6,30 23.7,28.2 23.7,31 23.7,29.6 23.7,28.9 23.7,30.3 23.7,31.7 23,32.1 22.2,32.1 18.4,33.3 19.3,33.3 20.2,33.3 14.81,31.94 15.51,31.94 17.14,36.45 17.2,37.2 16.31,36.45 12.5,20.5 12.5,19.3 15.26,18.39 17,17.2 18.4,17.2 17.7,17.2 19.1,17.2 19.8,17.2 20.5,17.2 21.2,17.2 21.9,17.2 22.5,17.4 25.8,17.4 26.6,17.4 25.8,16.6 26.6,16.6 25.8,20.8 26.5,20.8 27.2,20.8 27.4,22.6 27.4,21.4 27.4,23.7 27.4,24.5 0.6,10 0.5,17.9 0.5,26.6 0.6,34.5 1.5,39.8 8.92,39.42 9.3,48.53 21.85,40.74 29.3,40.5 8.7,1.2 10.5,7.8 12.7,2.4 22.4,2.5 32.2,2.4 41.7,2.4 51.3,2.9 60.9,2.4 61.6,2.4 61.2,5.4 61.2,6.6 61.3,10.4 61.3,9.4 61.2,13.1 61.2,14.2 60.7,17.2 61.6,17.2 73.2,10 66.1,1.5 48.1,30.1 49.7,30.1 46.4,30.7 45.7,30.7 44.8,32.5 44.8,31.8 45.8,33.3 45.1,33.3 48.5,33.3 49.7,27.3 48.1,25.8 52.4,33 52.4,32.3 51.9,31.5 51.6,37.2 52.3,37.2 50.7,36.3 50.7,35.6 54.6,32.5 54.6,31.8 56.8,32.3 56.8,31.6 54.6,30.3 54.6,31 57.5,31.59 54.64,33.68 62.6,23.9 62.6,26.8 62.6,26.1 58.2,37 58.9,37 57.4,36.1 57.4,35.4 59.8,35.2 59.8,36.3 60.7,36.9 61.4,36.9 62.2,36.1 62.2,35.4 73.4,34.5 73.4,33.8 72.7,35.4 72,35.4 71,34.6 71,33.9 67.1,24.1 67.1,23.4 65.4,24.8 66.1,24.8 66.8,24.8 65.5,26.9 65.5,26.2 65.5,27.6 55.5,25 55.5,23.9 55.5,22.5 58.3,24.8 58.3,24.1 62.6,27.5 73.2,25.1 73.2,20.7 64.9,19.1 68.4,19 65.9,29.2 71.9,31.1 61.8,33 69.5,26 69.5,29.4 51.2,23.8 49.4,21.7 48.7,21.7 48,18.8 48.7,18.8 49.4,18.8 49.8,18.1 49.8,17.4 46.4,27.3 45.6,24.8 45.8,22.1 42.9,25.8 40.2,27.1 42,29 39.2,20.8 43.3,19.4 38.8,12.8 28.8,12.5 28.6,15.6 34.2,14.7 35,14.7 42.9,14.6 43.9,14.6 23.3,14.6 24.4,14.6 13.8,14.7 15,14.7 54.2,27.3 55.37,35.61 54.1,24.9 69.5,22.9 71.7,22.9 67.1,21.4 58.8,32.9 55.4,27.3 62.6,22.3 62.6,21.6 52.2,40.2 65,40.2 74.2,41.2 66.5,48.3 2.5,34.5 2.5,26.6 2.5,17.8 2.5,10 0.6,24.5 0.6,20 0.47,7.57 36.6,23.9 29.8,24.3 29.8,32.9 29.5,28.6 32.8,36.6 37.4,34.9 8.98,21.83 9.2,16.12 9.52,16.76 9.77,17.45 9.9,18.15 12.96,23.5 12.27,23.5 11.57,23.5 11.63,22.86 12.46,21.47 10.74,20.83 10.68,20.13 10.68,19.44 10.68,18.74 7.69,18.61 7.5,17.98 7.25,17.34 7,16.77 7.25,19.12 6.93,19.82 7,20.58 6.93,21.34 7.06,22.17 6.93,22.86 6.93,23.56 6.93,24.26 6.93,24.9 9.15,24.33 7.9,25.3 12.33,22.86
  pour Bottom: -1.27,50.8 -1.27,-1.27 76.2,-1.27 76.2,50.8
  pour Top: -1.27,50.8 -1.27,-1.27 76.2,-1.27 76.2,50.8
MISO  (via drill 0.3)
  Top 0.254: U3.9 24.29,26.3 v32,26.3 37.7,26.3 v38.7,25.3 38.7,25.2 v40.8,23.1 | U1.16 42.36,21.64 v42.2,21.7 | MISO.TP 31.9,22.5 v31.9,24.3
  Bottom 0.254: JP1.1 38.9,30.65 38.9,25.5 v38.7,25.3 | v31.9,24.3 32,24.4 v32,26.3
  Bottom 0.305: v40.8,23.1 v42.2,21.7
MOSI  (via drill 0.3)
  Top 0.254: U3.7 25.05,25.1 35.6,25.1 v35.9,24.8 | v38.1,24.8 40.48,22.42 U1.15 | v32.9,24.3 32.9,21.8 MOSI.TP
  Bottom 0.254: JP1.4 37.64,25.26 v38.1,24.8 v35.9,24.8 34.6,23.5 33.5,23.5 32.9,24.1 v32.9,24.3
N$1
  Top 0.406: U5.16 67.45,20.55 arc90 JP2.D-
N$2
  Top 0.406: U5.15 68.78,19.91 arc90 JP2.D+
N$3
  Top 1.016: JP2.GND 70.48,32.4 70.39,32.49 | 70.39,32.49 C5.1 | FB1.1 72.14,32.49 70.39,32.49
N$4
  Top 1.016: JP2.VBUS 68.4,31.16 65.74,33.82 | FB2.1 65.66,33.9 65.74,33.82 | 65.74,33.82 C5.2
N$5
  Top 0.406: U5.17 66.02,21.2 C4.1
N$6
  Top 0.406: L9.1 J$2.SIG
N$7
  Top 0.305: 19,27.05 18.97,27.02 U3.14
  Top 0.406: R1.1 18.96,28.08 19,27.05
N$8
  Top 0.152: U3.29 20,21.32 20,20.05 21.33,20.05 C9.1
N$9
  Top 0.152: U3.26 18.48,20.61 18.5,20.6 18.94,20.6 C8.1 19.94,19.56
N$10
  Top 0.305: U3.21 16.07,23.57 14.76,22.25 C7.1
N$11
  Top 0.152: 25.1,24.58 arc-90 C6.1
  Top 0.254: U3.6 24.9,24.58 C6.1
N$12
  Top 0.305: U3.24 17.24,20.53 C10.2
N$13
  Top 0.152: U3.23 16.43,22.57 15.59,20.74
  Top 0.305: 15.59,20.74 15.59,19.23 C10.1
N$14
  Top 0.152: C11.1 26.09,19.84 Q1.1 23.96,20.7 21,20.7 20.98,20.73 U3.31
N$15
  Top 0.406: L9.2 8.4,30.48 arc90 C19.1 9.52,30.54 arc-90 L8.1
N$16
  Top 0.152: U3.30 20.5,20.4 22.2,20.4 22.2,19.2 22.96,18.44 Q1.3
  Top 0.305: Q1.3 23.12,17.1 C12.1
N$17
  Top 0.406: J$1.SIG 2.56,13.96
  Top 0.61: L4.2 8.87,19.12 arc-90 C14.2
  Top 1.016: J$1.SIG 3.73,13.97 arc90 8.87,19.12
N$18
  Top 0.406: C17.1 L7.1 C18.1 L8.2
N$19
  Top 0.406: C16.1 C17.2 L7.2
N$20  (via drill 0.3)
  Top 0.406: U5.2 58.04,27.7 58.04,28.83 57.66,29.21 v55.44,29.21 | v53.78,29.15 53.44,28.8 C34.2
  Bottom 0.406: v55.44,29.21 55.37,29.15 v53.78,29.15
N$21
  Top 0.406: L6.1 R2.1 C15.2
N$22
  Top 0.406: R3.1 LED1.A
N$23
  Top 0.406: R4.1 LED2.A
N$24
  Top 0.406: R5.1 LED3.A
N$25
  Top 0.406: R6.1 LED4.A
N$30
  Top 0.406: C35.1 18.23,32.03 U2.4
NSS  (via drill 0.3)
  Top 0.254: U3.11 20.49,27.6 30.7,27.6 | 30.7,27.6 38.5,27.6 42.86,23.24 U1.14 | v30.8,28.3 30.7,28.2 30.7,27.6
  Top 0.406: NSS.TP v30.8,24.3
  Bottom 0.406: v30.8,24.3 v30.8,28.3
SCK  (via drill 0.3)
  Top 0.254: U3.8 25.05,25.6 v36.2,25.6 41.61,20.19 U1.17 | v33.9,24.3 33.9,21 SCK.TP
  Bottom 0.254: JP1.3 36.4,30.69 36.4,25.6 v36.2,25.6 33.9,25.6 v33.9,24.3
UART_RX  (via drill 0.3)
  Top 0.254: UART_TX.TP v59.9,30.3
  Top 0.406: U1.31 54.06,26.44 v54.1,26.4 | v55.8,25.8 55.84,25.75 U5.5
  Bottom 0.254: v59.9,30.3 59.9,29.8 55.9,25.8 v55.8,25.8
  Bottom 0.406: v54.1,26.4 55.2,26.4 v55.8,25.8
UART_TX  (via drill 0.3)
  Top 0.254: UART_RX.TP 60.8,32.1 v59.1,32.1
  Top 0.406: U1.30 52.72,25.6 v51.4,25.6 | U5.1 57.28,28.3 v55.7,28.3
  Bottom 0.254: 57.28,28.3 59.1,30.12 v59.1,32.1
  Bottom 0.305: 57.28,28.3 v55.7,28.3
  Bottom 0.406: v51.4,25.6 54.1,28.3 v55.7,28.3
USB_NSLEEP
  Top 0.152: U6.3 53.85,32.07 53.85,31.05 53.84,30.21 54.8,29.25 54.8,22.3 55.92,21.18 57.36,21.18 U5.12
VCC_LOGIC  (1 unrouted)
  Top 0.406: U6.1 51.88,33.97 C30.1 51.85,34.04 U4.3 30.58,34.04 27.7,34.02 20.84,34.02 U2.1 20.23,36.74 C31.1 | U6.1 U6.2 | U6.1 53.46,36.06 USB_SW.TP
VCCIO
  Top 0.305: C3.1 57.49,33.02 57.15,33.02 | C2.1 57.48,30.5 58.33,30.5
  Top 0.406: U5.20 60.96,23.16 60.96,26.41 60.9,26.41 | 60.9,26.41 U5.4 | U6.6 U6.5 57.15,33.02 58.33,31.84 58.33,30.5 58.33,29.37 60.9,26.8 60.9,26.41 | USB.TP 62.95,36.9 FB2.2
  Top 1.016: FB2.2 62.8,34.05 C1.1 61.05,34.09 C3.1

### Text on the board
tNames: CubeSat Telecommand | r1 - Sept 2015 | RESET | ICSP | TX | RX
tValues: L1 | L2 | L3 | L4
202bmp: /home/phil/files-philcrump/Cubesat/uos3-pcb.bmp